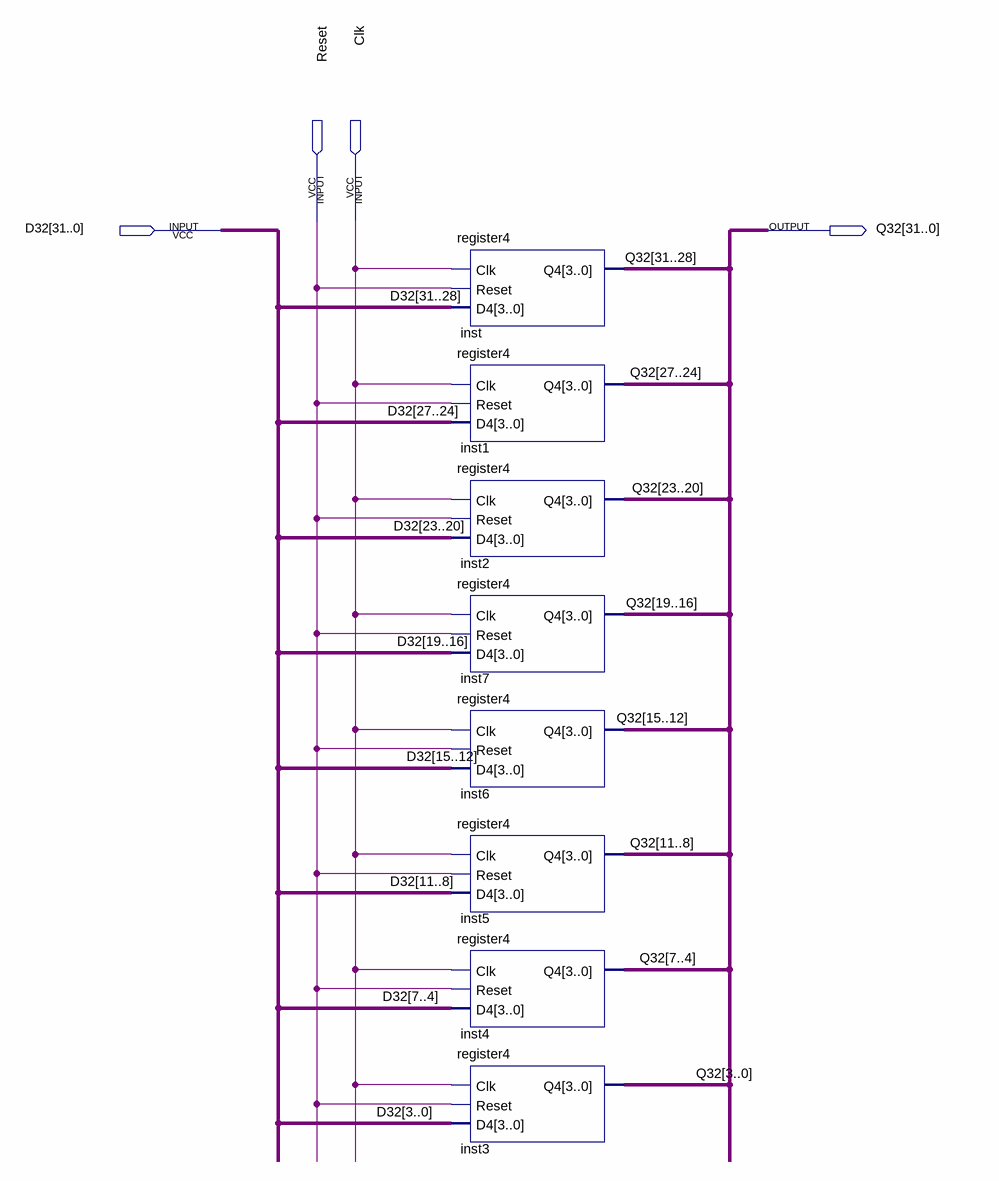
[diagram p0: schematic sheet]
// Quartus schematic register32.bdf as structural Verilog: 8 symbols, 4 pins
module register32 (
  input  Reset,
  input  Clk,
  input  [31:0] D32,
  output [31:0] Q32
);

  register4 inst (.Clk(Clk), .Reset(Reset), .D4(D32[31:28]), .Q4(Q32[31:28]));
  register4 inst1 (.Clk(Clk), .Reset(Reset), .D4(D32[27:24]), .Q4(Q32[27:24]));
  register4 inst2 (.Clk(Clk), .Reset(Reset), .D4(D32[23:20]), .Q4(Q32[23:20]));
  register4 inst7 (.Clk(Clk), .Reset(Reset), .D4(D32[19:16]), .Q4(Q32[19:16]));
  register4 inst6 (.Clk(Clk), .Reset(Reset), .D4(D32[15:12]), .Q4(Q32[15:12]));
  register4 inst5 (.Clk(Clk), .Reset(Reset), .D4(D32[11:8]), .Q4(Q32[11:8]));
  register4 inst4 (.Clk(Clk), .Reset(Reset), .D4(D32[7:4]), .Q4(Q32[7:4]));
  register4 inst3 (.Clk(Clk), .Reset(Reset), .D4(D32[3:0]), .Q4(Q32[3:0]));
endmodule
